# EasyEDA Pro project ProPrj_FL7375_2026-01-03.epro

# Board platine
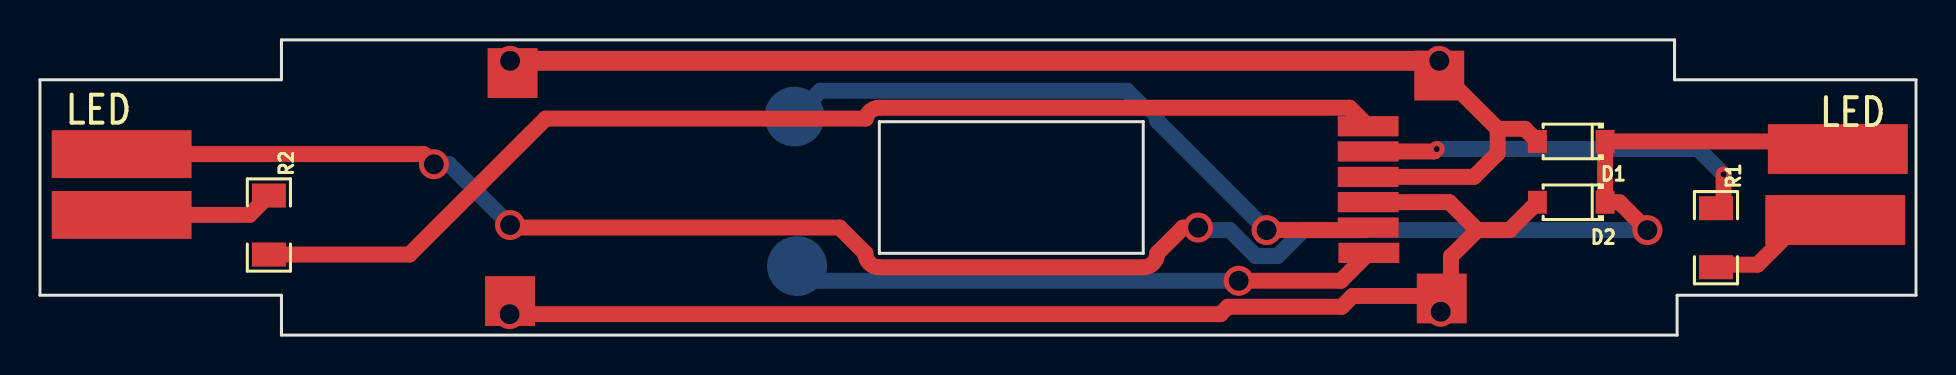
[diagram p0: board, top side]
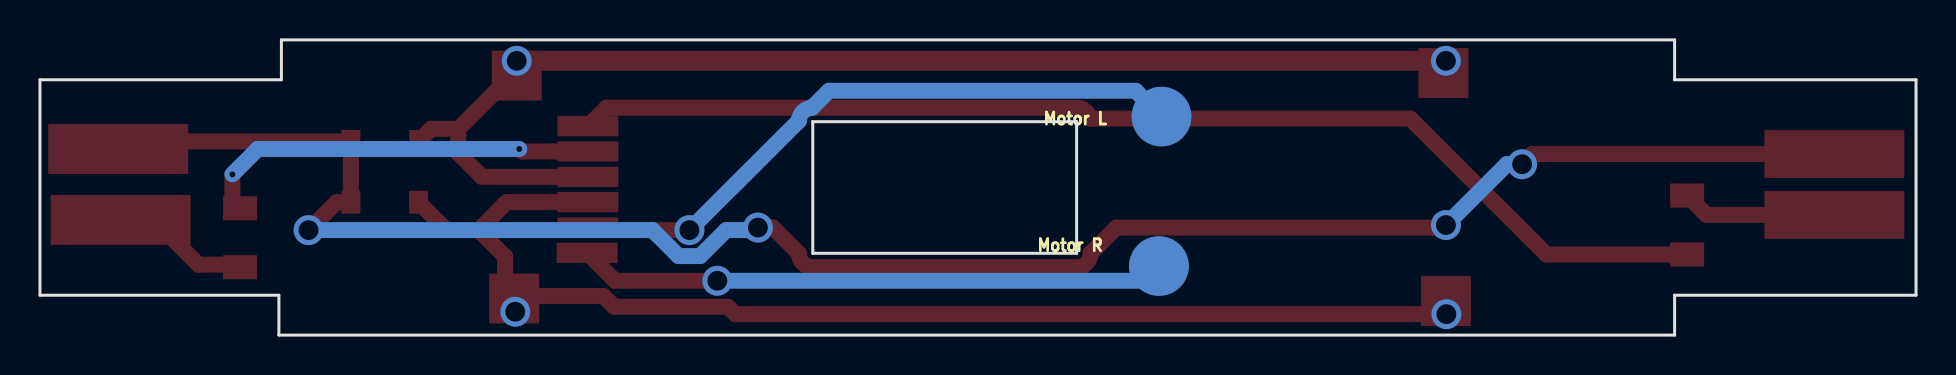
[diagram p1: board, bottom side, seen from below]

Outline 93.85 x 14.8 mm; copper layers: Top Layer, Bottom Layer. Coordinates in mm from the lower left corner of the outline.
Outline path: 0,12.8 12.08,12.8 12.08,14.8 81.77,14.8 81.77,12.8 93.85,12.8 93.85,2 81.9,2 81.9,0 12.08,0 12.08,2 0,2 0,12.8 ; 41.99,10.7 55.19,10.7 55.19,4.1 41.99,4.1 41.99,10.7
Stack: Top Layer 0.035mm / Dielectric1 1.51mm FR4 er 4.5 / Bottom Layer 0.035mm

## Design rules (mm)
spacing safeClearance (default): track to track 0.152, other pairs 0.152 to 0.3
track width trackWidth (default): min 0.127, default 0.254, max 2.54
differential pair differentialPair (default): width min 0.127, default 0.254, max 2.54; gap min 0.152, default 0.152
via viaSize (default): diameter min 0.5, default 0.61, max 10; hole min 0.3, default 0.305, max 6

## Placement (name value [footprint] x y rotation side)
D1  1N4148W  [SOD-123_L2.8-W1.8-LS3.7-RD-1]  76.6 9.71 180 top
D2  1N4148W  [SOD-123_L2.8-W1.8-LS3.7-RD-1]  76.6 6.66 180 top
Motor L  SolderWirePad_1x01_SMD_3x3mm  [SMDPad3x3mm:SolderWirePad_1x01_SMD_3x3mm]  37.99 9.45 180 bottom
Motor R  SolderWirePad_1x01_SMD_3x3mm  [SMDPad3x3mm:SolderWirePad_1x01_SMD_3x3mm]  38.12 1.96 180 bottom
NOREF  -  [Pad_e232]  66.44 10.47 0 top
NOREF#2  -  [Pad_e443]  70 13.01 0 top
NOREF#3  -  [Pad_e235]  66.44 6.67 0 top
NOREF#4  -  [Pad_e427]  23.52 1.71 180 top
NOREF#5  -  [Pad_e236]  66.44 5.39 0 top
NOREF#6  -  [Pad_e798]  4.08 9.07 0 top
NOREF#7  -  [Pad_e237]  66.48 4.12 0 top
NOREF#8  -  [Pad_e416]  23.64 13.14 0 top
NOREF#9  -  [Pad_e780]  89.94 9.33 0 top
NOREF#10  -  [Pad_e233]  66.44 9.21 0 top
NOREF#11  -  [Pad_e234]  66.44 7.93 0 top
NOREF#12  -  [Pad_e431]  70.12 1.83 180 top
NOREF#13  -  [Pad_e371]  4.08 6.03 0 top
NOREF#14  -  [Pad_e368]  89.81 5.77 0 top
R1  -  [R1206]  83.84 4.88 270 top
R2  1kΩ  [R1206]  11.45 5.52 270 top

## Footprints (pads in the part's own frame, mm; a bottom-side part is the same pattern mirrored in y, then rotated)
Pad_e232
  rect 3.048x1.016 smd: 6(0,0)
Pad_e233
  rect 3.048x1.016 smd: 5(0,0)
Pad_e234
  rect 3.048x1.016 smd: 4(0,0)
Pad_e235
  rect 3.048x1.016 smd: 3(0,0)
Pad_e236
  rect 3.048x1.016 smd: 2(0,0)
Pad_e237
  rect 3.048x1.016 smd: 1(0,0)
Pad_e368
  rect 7x2.5 smd: 4(0,0)
Pad_e371
  rect 7x2.4 smd: 4(0,0)
Pad_e416
  rect 2.5x2.5 smd: 4(0,0)
Pad_e427
  rect 2.5x2.5 smd: 4(0,0)
Pad_e431
  rect 2.5x2.5 smd: 4(0,0)
Pad_e443
  rect 2.5x2.5 smd: 4(0,0)
Pad_e780
  rect 7x2.5 smd: VCC(0,0)
Pad_e798
  rect 7x2.4 smd: 4(0,0)
R1206
  rect 1.208x1.701 smd: 1(-1.479,0) 2(1.479,0)
SMDPad3x3mm:SolderWirePad_1x01_SMD_3x3mm
  rrect 3x3 smd: 1(0.25,1.5)
SOD-123_L2.8-W1.8-LS3.7-RD-1
  rect 0.95x1.15 smd: 1(-1.692,0) 2(1.692,0)

## Nets
+: D1.1 D2.1 NOREF#6.4 NOREF#9.VCC
GLEISL: D1.2 NOREF#2.4 NOREF#8.4 NOREF#11.4
GLEISR: D2.2 NOREF#3.3 NOREF#4.4 NOREF#12.4
LEDH: NOREF#13.4 R2.1
LEDV: NOREF#14.4 R1.2
LICHTH: NOREF.6 R2.2
LICHTV: NOREF#10.5 R1.1
MOTOR_A: Motor R.1 NOREF#7.1
MOTOR_B: Motor L.1 NOREF#5.2

## Via types
v1: diameter 1.5, hole 1, Top Layer to Bottom Layer, 10 vias
v2: diameter 0.61, hole 0.305, Top Layer to Bottom Layer, 2 vias

## Routing (per net, layer and track width the routed paths; a pad name or vN(x,y) marks a point on that pad's centre or on a via; arc(x,y) is an arc through that point)
+: length 98.9
  Top Layer w0.8: 90.19,8.82 89.3,9.71 D1.1 D2.1 79.02,6.66 v1(80.41,5.26) ; v1(19.71,8.57) 19.2,9.07 NOREF#6.4 ; v1(23.52,5.52) 23.64,5.39 40,5.39 41.29,4.1 arc(41.5,3.61) 41.99,3.4 55.19,3.4 arc(55.68,3.61) 55.89,4.1 57.18,5.39 v1(57.93,5.39)
  Bottom Layer w0.8: v1(23.52,5.52) 20.47,8.57 v1(19.71,8.57) ; v1(80.41,5.26) 63.2,5.26 61.9,3.96 60.82,3.96 59.52,5.26 58.06,5.26 v1(57.93,5.39)
GLEISL: length 61.5
  Top Layer w0.8: D1.2 74.28,10.34 72.92,10.34 ; 72.92,10.34 70,13.26 v1(70,13.75) ; 72.92,10.34 72.92,9.12 71.74,7.93 66.44,7.93
  Top Layer w1: v1(23.52,13.75) v1(70,13.75)
GLEISR: length 62
  Top Layer w0.8: 70.58,1.89 70.51,1.96 65.66,1.96 65.12,1.42 59.43,1.42 59.05,1.05 v1(23.49,1.05) ; 70.58,1.89 70.07,1.38 v1(70.07,1.17) ; 70.58,1.89 70.58,3.94 71.9,5.26 ; 70.58,1.89 70.63,1.83 ; D2.2 73.51,5.26 71.9,5.26 ; 71.9,5.26 70.5,6.67 NOREF#3.3
LEDH: length 7.8
  Top Layer w0.8: NOREF#13.4 10.48,6.03 R2.1
LEDV: length 7.4
  Top Layer w0.8: 90.19,5.77 90.06,5.9 88.29,5.9 85.92,3.53 83.97,3.53 R1.2
LICHTH: length 58.5
  Top Layer w0.8: NOREF.6 65.51,11.4 41.99,11.4 arc(41.55,11.25) 41.31,10.85 25.29,10.85 18.48,4.04 R2.2
LICHTV: length 20.2
  Top Layer w0.8: NOREF#10.5 69.75,9.21 v2(69.87,9.33) ; v2(84.22,8.06) 84.22,6.74 R1.1
  Bottom Layer w0.8: v2(84.22,8.06) 82.95,9.33 v2(69.87,9.33)
MOTOR_A: length 29.5
  Top Layer w0.8: v1(59.96,2.72) 65.08,2.72 NOREF#7.1
  Bottom Layer w0.8: v1(59.96,2.72) 38.61,2.72 Motor R.1
MOTOR_B: length 32.3
  Top Layer w0.8: NOREF#5.2 66.31,5.26 v1(61.36,5.26)
  Bottom Layer w0.8: Motor L.1 39.04,12.25 54.38,12.25 55.23,11.4 arc(55.68,11.19) 55.89,10.74 v1(61.36,5.26)

## Text on the board
Top Silkscreen Layer: LED
